# EAGLE design CD1200plus_pcb_07 (EAGLE 8.3.1)
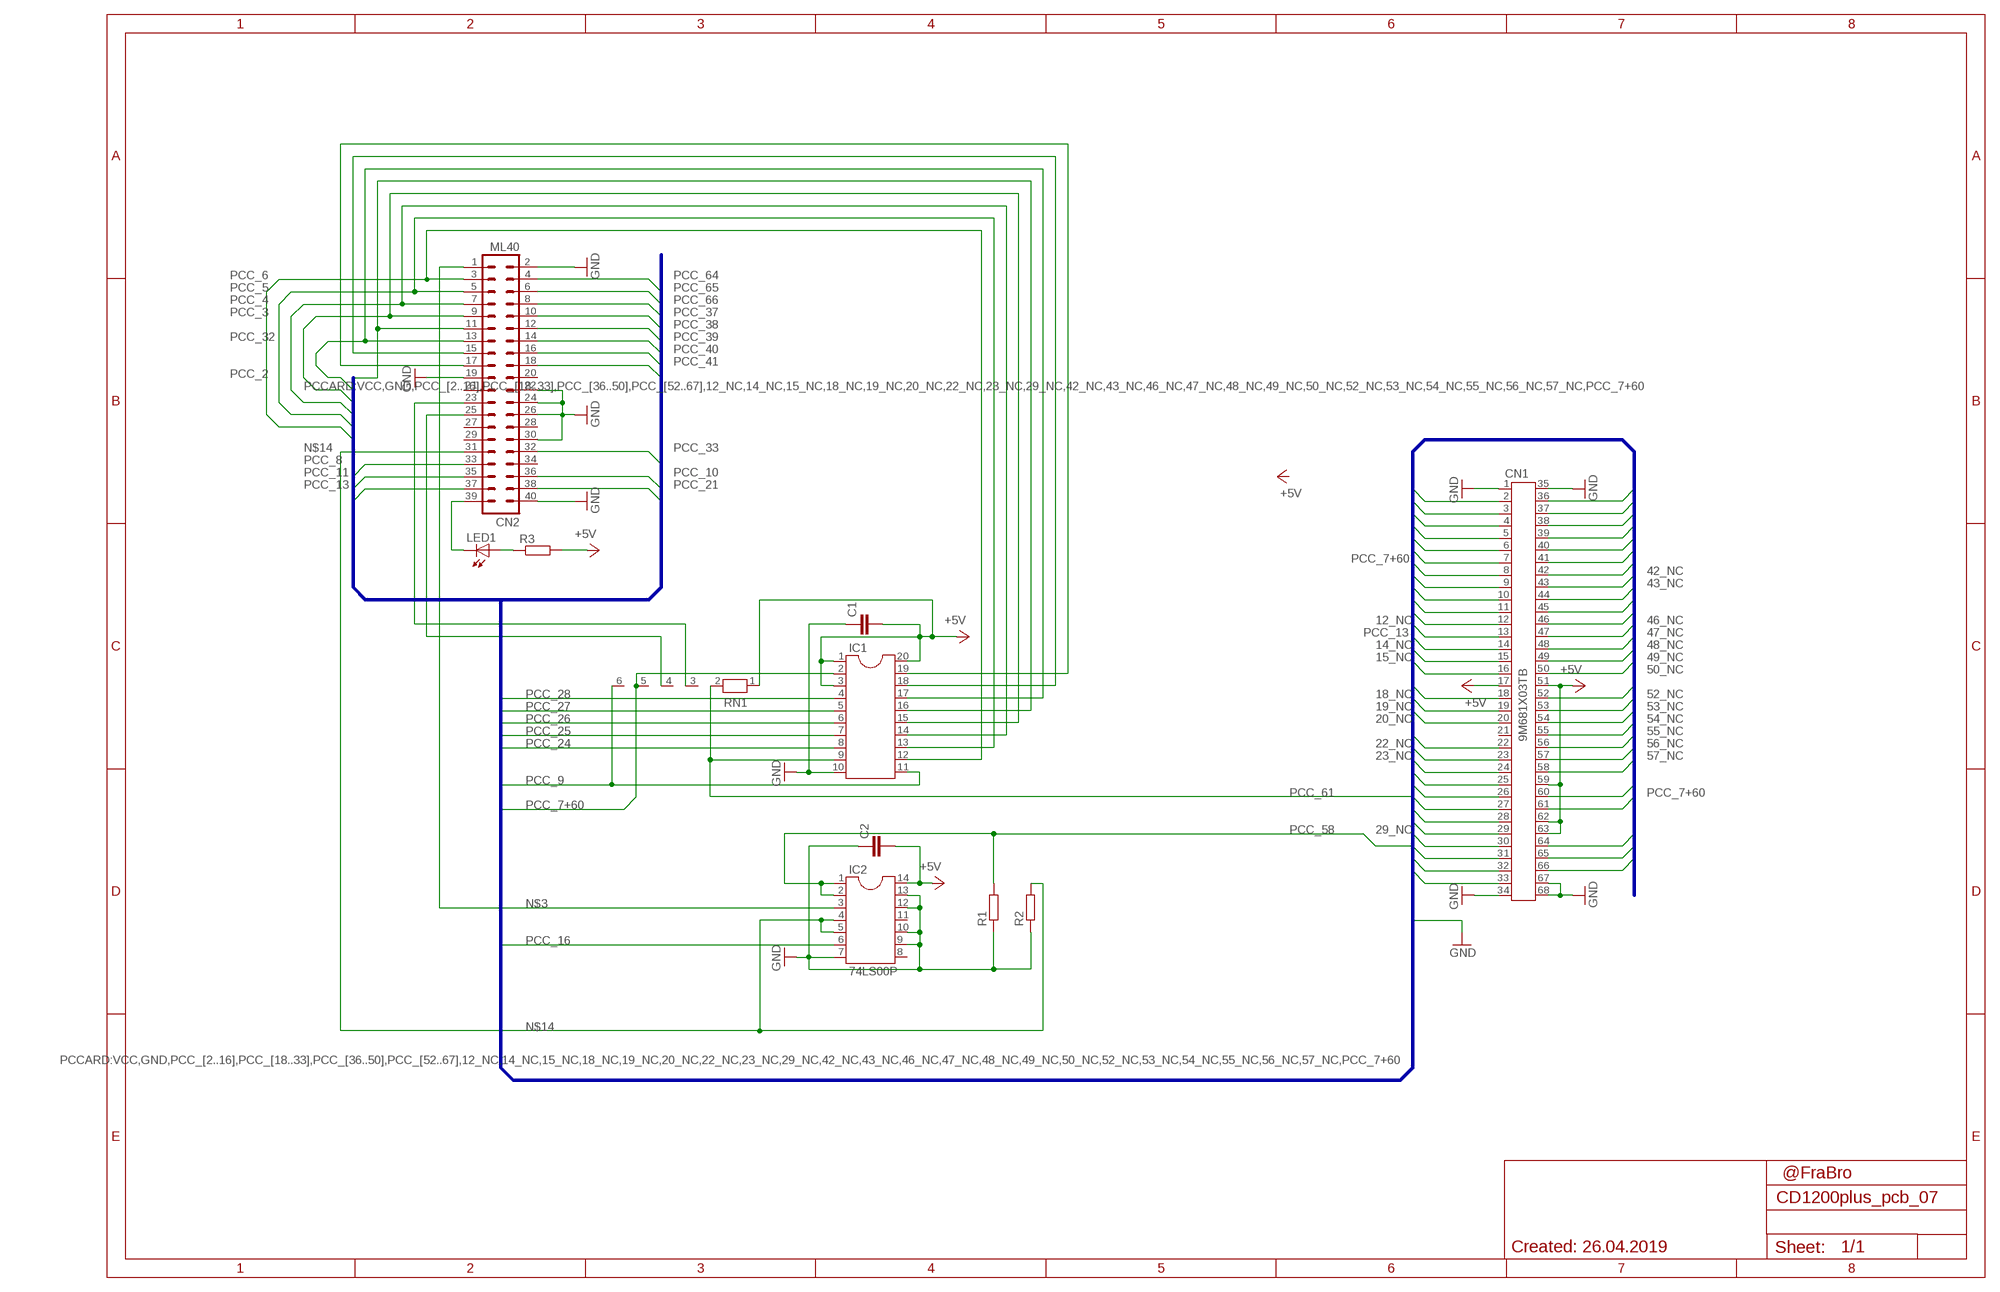
[diagram p0: schematic, sheet 1]

## Parts
C1  C-EU050-035X075  [C050-035X075]
C2  C-EU050-035X075  [C050-035X075]
CN1  9M681X03TB  [9M681X03]
CN2  ML40  [ML40]
IC1  DIL20  [DIL20]
IC2  74LS00P  DIL14  [DIL14]
LED1  LEDSML1206  [SML1206]
R1  R-EU_M1206  [M1206]
R2  R-EU_M1206  [M1206]
R3  R-EU_M1206  [M1206]
RN1  RN05  [RN-6]

## Nets
12_NC: CN1.12
14_NC: CN1.14
15_NC: CN1.15
18_NC: CN1.18
19_NC: CN1.19
20_NC: CN1.20
22_NC: CN1.22
23_NC: CN1.23
29_NC: CN1.29
42_NC: CN1.42
43_NC: CN1.43
46_NC: CN1.46
47_NC: CN1.47
48_NC: CN1.48
49_NC: CN1.49
50_NC: CN1.50
52_NC: CN1.52
53_NC: CN1.53
54_NC: CN1.54
55_NC: CN1.55
56_NC: CN1.56
57_NC: CN1.57
+5V: C1.2 C2.2 CN1.17 CN1.51 CN1.59 CN1.62 CN1.63 IC1.1 IC1.3 IC1.20 IC2.14 R3.2 RN1.1
GND: C1.1 C2.1 CN1.1 CN1.34 CN1.35 CN1.67 CN1.68 CN2.2 CN2.19 CN2.22 CN2.24 CN2.26 CN2.30 CN2.40 IC1.10 IC2.7 IC2.9 IC2.10 IC2.12 IC2.13 R1.1 R2.1
N$1: CN2.23 RN1.3
N$2: CN2.25 RN1.4
N$3: CN2.1 IC2.3
N$4: LED1.A R3.1
N$5: CN2.39 LED1.C
N$11: CN2.15 IC1.18
N$12: CN2.17 IC1.19
N$14: CN2.31 IC2.4 IC2.5 R2.2
PCC_2: CN1.2 CN2.11 IC1.16
PCC_3: CN1.3 CN2.9 IC1.15
PCC_4: CN1.4 CN2.7 IC1.14
PCC_5: CN1.5 CN2.5 IC1.13
PCC_6: CN1.6 CN2.3 IC1.12
PCC_7+60: CN1.7 CN1.60 IC1.2 RN1.5
PCC_8: CN1.8 CN2.33
PCC_9: CN1.9 IC1.11 RN1.6
PCC_10: CN1.10 CN2.36
PCC_11: CN1.11 CN2.35
PCC_13: CN1.13 CN2.37
PCC_16: CN1.16 IC2.6
PCC_21: CN2.38
PCC_24: CN1.24 IC1.8
PCC_25: CN1.25 IC1.7
PCC_26: CN1.26 IC1.6
PCC_27: CN1.27 IC1.5
PCC_28: CN1.28 IC1.4
PCC_30: CN1.30
PCC_31: CN1.31
PCC_32: CN1.32 CN2.13 IC1.17
PCC_33: CN1.33 CN2.32
PCC_36: CN1.36
PCC_37: CN1.37 CN2.10
PCC_38: CN1.38 CN2.12
PCC_39: CN1.39 CN2.14
PCC_40: CN1.40 CN2.16
PCC_41: CN1.41 CN2.18
PCC_44: CN1.44
PCC_45: CN1.45
PCC_58: CN1.58 IC2.1 IC2.2 R1.2
PCC_61: CN1.61 IC1.9 RN1.2
PCC_64: CN1.64 CN2.4
PCC_65: CN1.65 CN2.6
PCC_66: CN1.66 CN2.8
Unconnected: CN1.21 CN2.20 CN2.21 CN2.27 CN2.28 CN2.29 CN2.34 IC2.8 IC2.11

## Buses
PCCARD:VCC,GND,PCC_[2..16],PCC_[18..33],PCC_[36..50],PCC_[52..67],12_NC,14_NC,15_NC,18_NC,19_NC,20_NC,22_NC,23_NC,29_NC,42_NC,43_NC,46_NC,47_NC,48_NC,49_NC,50_NC,52_NC,53_NC,54_NC,55_NC,56_NC,57_NC,PCC_7+60

## Notes on the sheet
- @FraBro
- Created: 26.04.2019

## Library data of the parts
C1 C2 = resistor:C-EU: CAPACITOR, European symbol
CN1 = con-3m:9M681X03TB: CONNECTOR PCMCIA-CompactFlash; OC_FARNELL: unknown; OC_NEWARK: unknown
CN2 = FLACHBAN@2:ML40
IC1 = ic-package:DIL20: Dual In Line / Socket
IC2 = ic-package:DIL14: Dual In Line / Socket
LED1 = led:LED: LED OSRAM: - CHIPLED LG R971, LG N971, LY N971, LG Q971, LY Q971, LO R971, LY R971 LH N974, LH R974 LS Q976, LO Q976, LY Q976 LO Q996 - Hyper CHIPLED LW Q18S LB Q993, LB Q99A, LB R99A - SideLED LS A670, LO A670, LY A670, LG A670, LP A670 LB A673, LV A673, LT A673, LW A673 LH A674 LY A675 LS A676, LA A676, LO A676, LY A676, LW A676 LS A679, LY A679, LG A679 - Hyper Micro SIDELED® LS Y876, LA Y876, LO Y876, LY Y876 LT Y87S - SmartLED LW L88C, LW L88S LB L89C, LB L89S, LG L890 LS L89K, LO L89K, LY L89K LS L896, LA L896, LO L896, LY L896 - TOPLED LS T670, LO T670, LY T670, LG T670, LP T670 LSG T670, LSP T670, LSY T670, LOP T670, LYG T670 LG T671, LOG T671, LSG T671 LB T673, LV T673, LT T673, LW T673 LH T674 LS T676, LA T676, LO T676, LY T676, LB T676, LH T676, LSB T676, LW T676 LB T67C, LV T67C, LT T67C, LS T67K, LO T67K, LY T67K, LW E67C LS E67B, LA E67B, LO E67B, LY E67B, LB E67C, LV E67C, LT E67C LW T67C LS T679, LY T679, LG T679 LS T770, LO T770, LY T770, LG T770, LP T770 LB T773, LV T773, LT T773, LW T773 LH T774 LS E675, LA E675, LY E675, LS T675 LS T776, LA T776, LO T776, LY T776, LB T776 LHGB T686 LT T68C, LB T68C - Hyper Mini TOPLED® LB M676 - Mini TOPLED Santana® LG M470 LS M47K, LO M47K, LY M47K Source: http://www.osram.convergy.de LUXEON: - LUMILED® LXK2-PW12-R00, LXK2-PW12-S00, LXK2-PW14-U00, LXK2-PW14-V00 LXK2-PM12-R00, LXK2-PM12-S00, LXK2-PM14-U00 LXK2-PE12-Q00, LXK2-PE12-R00, LXK2-PE12-S00, LXK2-PE14-T00, LXK2-PE14-U00 LXK2-PB12-K00, LXK2-PB12-L00, LXK2-PB12-M00, LXK2-PB14-N00, LXK2-PB14-P00, LXK2-PB14-Q00 LXK2-PR12-L00, LXK2-PR12-M00, LXK2-PR14-Q00, LXK2-PR14-R00 LXK2-PD12-Q00, LXK2-PD12-R00, LXK2-PD12-S00 LXK2-PH12-R00, LXK2-PH12-S00 LXK2-PL12-P00, LXK2-PL12-Q00, LXK2-PL12-R00 Source: www.luxeon.com KINGBRIGHT: KA-3528ASYC Source: www.kingbright.com
R1-R3 = resistor:R-EU_: RESISTOR, European symbol
RN1 = resistor-net:RN05: RESISTOR NETWORK; OC_FARNELL: unknown; OC_NEWARK: unknown

## Board
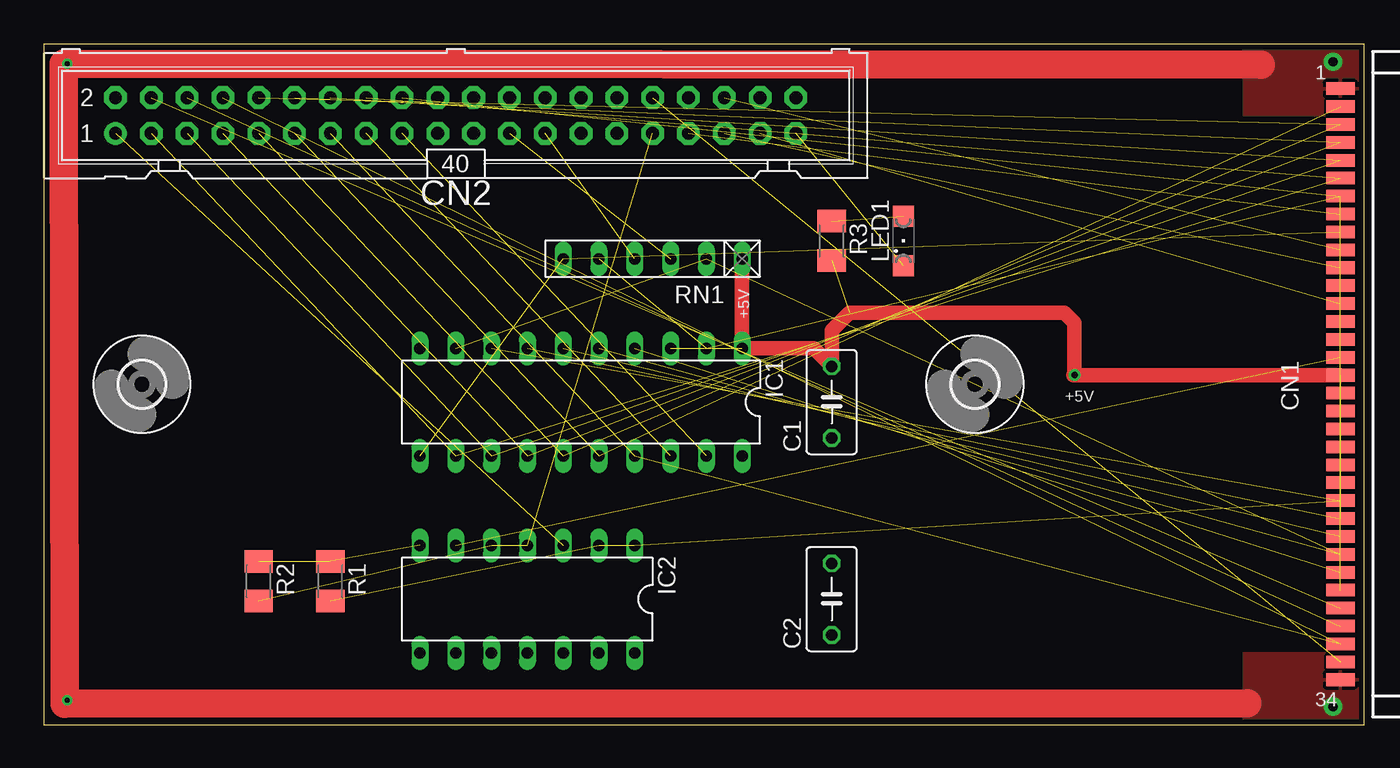
[diagram p1: board, top side]
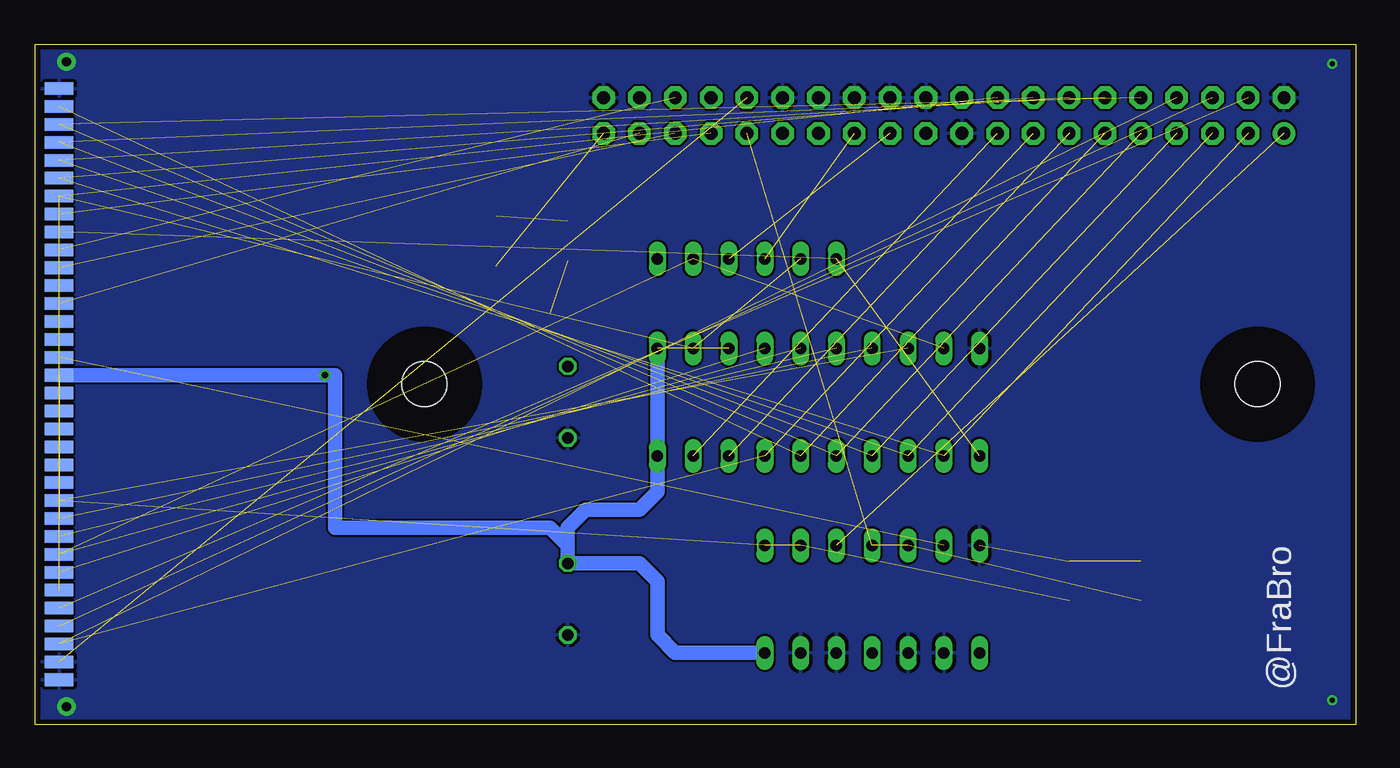
[diagram p2: board, bottom side, seen from below]

Size 93.65 x 48.25 mm. Coordinates in mm from the lower left corner, seen from the top.
Outline: 0,0 93.65,0 93.65,48.25 0,48.25 0,0
Copper layers (1*16): Top 0.0356mm / dielectric 1.5011mm / Bottom 0.0356mm
Design rules "oshpark-2layer": minimum track width 6mil, minimum drill 13mil, track to track 6mil, track to pad 6mil, pad to pad 6mil, via to via 6mil, smd to smd 6mil, copper to edge 15mil, drill to drill 6mil, minimum pad ring 7mil, minimum via ring 7mil, stop-mask expansion 2.5mil, vias tented up to drill 0mil, thermal gap 10mil

### Footprints (pad centres in the part's own frame; a part is rotated, then mirrored left to right if it is on the bottom)
C050-035X075 = drill 0.813 octagon: 1 -2.54,0; 2 2.54,0
9M681X03 = smd 0.89 x 2.03: 1 -20.955,-3.29; 2 -19.685,-3.29; 3 -18.415,-3.29; 4 -17.145,-3.29; 5 -15.875,-3.29; 6 -14.605,-3.29; 7 -13.335,-3.29; 8 -12.065,-3.29; 9 -10.795,-3.29; 10 -9.525,-3.29; 11 -8.255,-3.29; 12 -6.985,-3.29; 13 -5.715,-3.29; 14 -4.445,-3.29; 15 -3.175,-3.29; 16 -1.905,-3.29; 17 -0.635,-3.29; 18 0.635,-3.29; 19 1.905,-3.29; 20 3.175,-3.29; 21 4.445,-3.29; 22 5.715,-3.29; 23 6.985,-3.29; 24 8.255,-3.29; 25 9.525,-3.29; 26 10.795,-3.29; 27 12.065,-3.29; 28 13.335,-3.29; 29 14.605,-3.29; 30 15.875,-3.29; 31 17.145,-3.29; 32 18.415,-3.29; 33 19.685,-3.29; 34 20.955,-3.29 | smd 0.89 x 2.03 bottom: 35 -20.955,-3.29; 36 -19.685,-3.29; 37 -18.415,-3.29; 38 -17.145,-3.29; 39 -15.875,-3.29; 40 -14.605,-3.29; 41 -13.335,-3.29; 42 -12.065,-3.29; 43 -10.795,-3.29; 44 -9.525,-3.29; 45 -8.255,-3.29; 46 -6.985,-3.29; 47 -5.715,-3.29; 48 -4.445,-3.29; 49 -3.175,-3.29; 50 -1.905,-3.29; 51 -0.635,-3.29; 52 0.635,-3.29; 53 1.905,-3.29; 54 3.175,-3.29; 55 4.445,-3.29; 56 5.715,-3.29; 57 6.985,-3.29; 58 8.255,-3.29; 59 9.525,-3.29; 60 10.795,-3.29; 61 12.065,-3.29; 62 13.335,-3.29; 63 14.605,-3.29; 64 15.875,-3.29; 65 17.145,-3.29; 66 18.415,-3.29; 67 19.685,-3.29; 68 20.955,-3.29
ML40 = drill 0.914 pad 1.6: 1 -24.13,-1.27 | drill 0.914 pad 1.6 octagon: 2 -24.13,1.27; 3 -21.59,-1.27; 4 -21.59,1.27; 5 -19.05,-1.27; 6 -19.05,1.27; 7 -16.51,-1.27; 8 -16.51,1.27; 9 -13.97,-1.27; 10 -13.97,1.27; 11 -11.43,-1.27; 12 -11.43,1.27; 13 -8.89,-1.27; 14 -8.89,1.27; 15 -6.35,-1.27; 16 -6.35,1.27; 17 -3.81,-1.27; 18 -3.81,1.27; 19 -1.27,-1.27; 20 -1.27,1.27; 21 1.27,-1.27; 22 1.27,1.27; 23 3.81,-1.27; 24 3.81,1.27; 25 6.35,-1.27; 26 6.35,1.27; 27 8.89,-1.27; 28 8.89,1.27; 29 11.43,-1.27; 30 11.43,1.27; 31 13.97,-1.27; 32 13.97,1.27; 33 16.51,-1.27; 34 16.51,1.27; 35 19.05,-1.27; 36 19.05,1.27; 37 21.59,-1.27; 38 21.59,1.27; 39 24.13,-1.27; 40 24.13,1.27
DIL20 = drill 0.813 long: 1 -11.43,-3.81; 2 -8.89,-3.81; 3 -6.35,-3.81; 4 -3.81,-3.81; 5 -1.27,-3.81; 6 1.27,-3.81; 7 3.81,-3.81; 8 6.35,-3.81; 9 8.89,-3.81; 10 11.43,-3.81; 11 11.43,3.81; 12 8.89,3.81; 13 6.35,3.81; 14 3.81,3.81; 15 1.27,3.81; 16 -1.27,3.81; 17 -3.81,3.81; 18 -6.35,3.81; 19 -8.89,3.81; 20 -11.43,3.81
DIL14 = drill 0.813 long: 1 -7.62,-3.81; 2 -5.08,-3.81; 3 -2.54,-3.81; 4 0,-3.81; 5 2.54,-3.81; 6 5.08,-3.81; 7 7.62,-3.81; 8 7.62,3.81; 9 5.08,3.81; 10 2.54,3.81; 11 0,3.81; 12 -2.54,3.81; 13 -5.08,3.81; 14 -7.62,3.81
SML1206 = smd 1.5 x 1.5: A 1.75,0; C -1.75,0
M1206 = smd 1.6 x 2: 1 -1.4,0; 2 1.4,0
RN-6 = drill 0.813 long: 1 -6.35,0; 2 -3.81,0; 3 -1.27,0; 4 1.27,0; 5 3.81,0; 6 6.35,0
3,2 = hole 3.2: 0,0

### Placement (x,y rotation side)
C1  55.88,22.86 90 top
C2  55.88,8.89 90 top
CN1  95.25,24.13 270 top
CN2  29.21,43.18 0 top
IC1  38.1,22.86 180 top
IC2  34.29,8.89 180 top
LED1  60.96,34.29 90 top
R1  20.32,10.16 270 top
R2  15.24,10.16 270 top
R3  55.88,34.29 270 top
RN1  43.18,33.02 180 top
U$1  [3,2]  6.96,24.13 0 top
U$2  [3,2]  66.04,24.13 0 top

### Tracks (layer width: path | path; a pad name or v marks a point on that pad's centre or on a via)
+5V  (via drill 0.45)  (6 unrouted)
  Top 1.016: CN1.51 73.03,24.77 | RN1.1 IC1.1 54.61,26.67 C1.2 55.88,27.94 57.15,29.21 72.39,29.21 73.1,28.5 v73.1,24.79
  Bottom 1.016: CN1.51 72.39,24.77 72.39,13.97 57.15,13.97 55.88,12.7 C2.2 | C2.2 55.88,13.97 54.61,15.24 50.8,15.24 49.53,16.51 IC1.20 IC1.1 | C2.2 50.8,11.43 49.53,10.16 49.53,6.35 48.26,5.08 IC2.14
GND  (via drill 0.35, 0.65 pad 1.3)  (2 unrouted)
  Top 2.032: 85.34,1.5 1.47,1.47 1.42,46.84 86.31,46.79
  other vias: 91.44,46.99 91.44,1.27 1.65,1.73 1.65,46.86
  pour Bottom: 0,48.26 93.98,48.26 93.98,0 0,0
  pour Top: 93.98,48.26 93.98,43.18 85.09,43.18 85.09,48.26
  pour Top: 93.98,0 85.09,0 85.09,5.08 93.98,5.08
N$1  (1 unrouted)
N$2  (1 unrouted)
N$3  (1 unrouted)
N$4  (1 unrouted)
N$5  (1 unrouted)
N$11  (1 unrouted)
N$12  (1 unrouted)
N$14  (3 unrouted)
PCC_2  (2 unrouted)
PCC_3  (2 unrouted)
PCC_4  (2 unrouted)
PCC_5  (2 unrouted)
PCC_6  (2 unrouted)
PCC_7+60  (3 unrouted)
PCC_8  (1 unrouted)
PCC_9  (2 unrouted)
PCC_10  (1 unrouted)
PCC_11  (1 unrouted)
PCC_13  (1 unrouted)
PCC_16  (1 unrouted)
PCC_24  (1 unrouted)
PCC_25  (1 unrouted)
PCC_26  (1 unrouted)
PCC_27  (1 unrouted)
PCC_28  (1 unrouted)
PCC_32  (2 unrouted)
PCC_33  (1 unrouted)
PCC_37  (1 unrouted)
PCC_38  (1 unrouted)
PCC_39  (1 unrouted)
PCC_40  (1 unrouted)
PCC_41  (1 unrouted)
PCC_58  (3 unrouted)
PCC_61  (2 unrouted)
PCC_64  (1 unrouted)
PCC_65  (1 unrouted)
PCC_66  (1 unrouted)

### Text on the board
tNames: 1 | +5V | +5V | 34
bNames: @FraBro
Measures: PCMCIA / Slot in | Case Limit / A1200